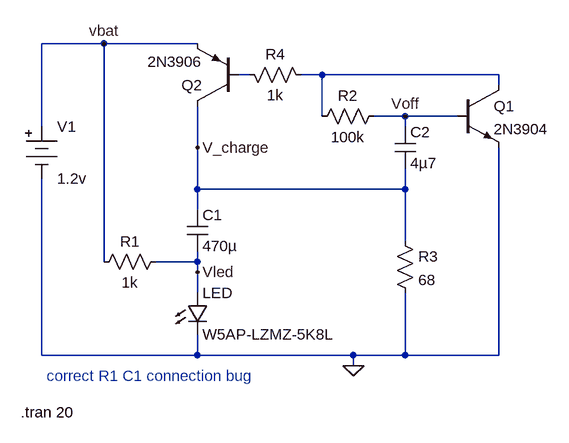
[diagram p0: schematic xiaolaba_1v2_LED_flasher.asc]
xiaolaba_1v2_LED_flasher.asc, the LTspice schematic file:
Version 4
SHEET 1 880 680
WIRE -192 -64 -288 -64
WIRE -48 -64 -192 -64
WIRE 32 -16 16 -16
WIRE 144 -16 112 -16
WIRE 416 -16 144 -16
WIRE 416 0 416 -16
WIRE 144 48 144 -16
WIRE 272 48 224 48
WIRE 352 48 272 48
WIRE -288 64 -288 -64
WIRE 272 64 272 48
WIRE -48 96 -48 32
WIRE -48 160 -48 96
WIRE 272 160 272 128
WIRE 272 160 -48 160
WIRE -48 192 -48 160
WIRE 272 240 272 160
WIRE -192 272 -192 -64
WIRE -48 272 -48 256
WIRE -48 272 -112 272
WIRE -48 288 -48 272
WIRE -48 320 -48 288
WIRE -288 416 -288 144
WIRE -48 416 -48 384
WIRE -48 416 -288 416
WIRE 192 416 -48 416
WIRE 272 416 272 320
WIRE 272 416 192 416
WIRE 416 416 416 96
WIRE 416 416 272 416
WIRE 192 432 192 416
FLAG 192 432 0
FLAG -48 288 Vled
FLAG -48 96 V_charge
FLAG -192 -64 vbat
FLAG 272 48 Voff
SYMBOL cap -64 192 R0
SYMATTR InstName C1
SYMATTR Value 470µ
SYMBOL cap 256 64 R0
SYMATTR InstName C2
SYMATTR Value 4µ7
SYMBOL res -96 256 R90
WINDOW 0 0 56 VBottom 2
WINDOW 3 32 56 VTop 2
SYMATTR InstName R1
SYMATTR Value 1k
SYMBOL res 128 64 R270
WINDOW 0 32 56 VTop 2
WINDOW 3 0 56 VBottom 2
SYMATTR InstName R2
SYMATTR Value 100k
SYMBOL res 256 224 R0
SYMATTR InstName R3
SYMATTR Value 68
SYMBOL res 128 0 M270
WINDOW 0 32 56 VTop 2
WINDOW 3 0 56 VBottom 2
SYMATTR InstName R4
SYMATTR Value 1k
SYMBOL npn 352 0 R0
SYMATTR InstName Q1
SYMATTR Value 2N3904
SYMBOL pnp 16 32 R180
SYMATTR InstName Q2
SYMATTR Value 2N3906
SYMBOL LED -64 320 R0
SYMATTR InstName LED
SYMATTR Value W5AP-LZMZ-5K8L
SYMBOL Misc\\battery -288 48 R0
SYMATTR InstName V1
SYMATTR Value 1.2v
TEXT -320 504 Left 2 !.tran 20
TEXT -280 448 Left 2 ;correct R1 C1 connection bug

The netlist it stands for:
* xiaolaba_1v2_LED_flasher.asc
C1 V_charge Vled 470µ
C2 Voff V_charge 4µ7
R1 Vled vbat 1k
R2 N002 Voff 100k
R3 V_charge 0 68
R4 N002 N001 1k
Q1 N002 Voff 0 0 2N3904
Q2 V_charge N001 vbat 0 2N3906
D§LED Vled 0 W5AP-LZMZ-5K8L
V1 vbat 0 1.2v
.model D D
.lib standard.dio
.model NPN NPN
.model PNP PNP
.lib standard.bjt
.tran 20
* correct R1 C1 connection bug
.backanno
.end